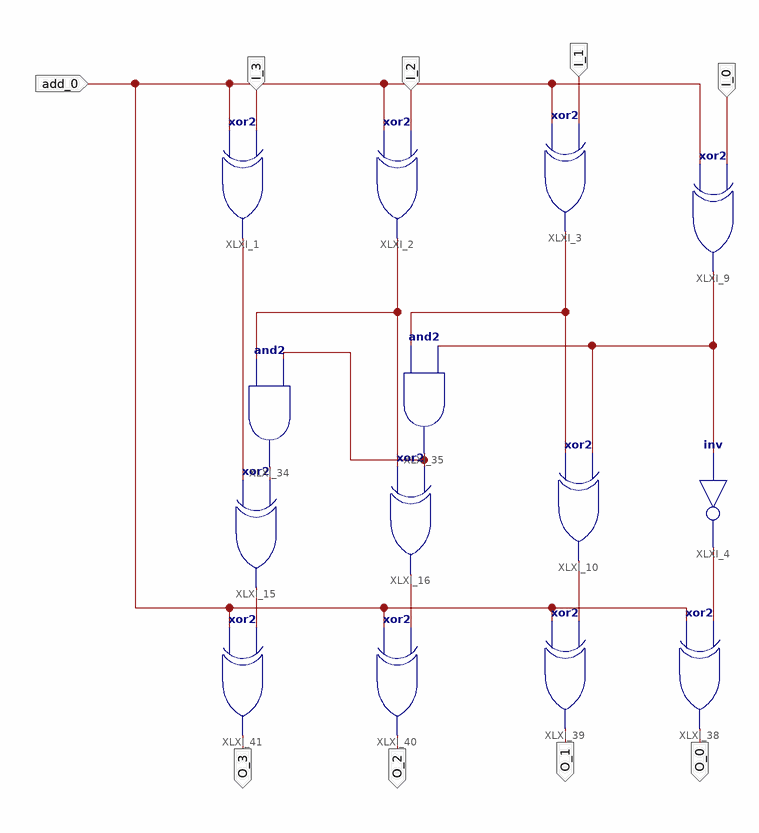
[diagram p0: schematic sheet 1]
// Xilinx ISE schematic Add_sub_4bit.sch (spartan3e) as structural Verilog: 14 symbols, 9 ports
module Add_sub_4bit (
  input  I_3,
  input  I_2,
  input  I_1,
  input  I_0,
  input  add_0,
  output O_3,
  output O_2,
  output O_1,
  output O_0
);

  wire XLXN_2, XLXN_3, XLXN_4, XLXN_52, XLXN_55, XLXN_57, XLXN_63, XLXN_64, XLXN_65, XLXN_66;

  xor XLXI_1 (XLXN_2, add_0, I_3);
  xor XLXI_2 (XLXN_3, add_0, I_2);
  xor XLXI_3 (XLXN_4, add_0, I_1);
  not XLXI_4 (XLXN_63, XLXN_52);
  xor XLXI_9 (XLXN_52, add_0, I_0);
  xor XLXI_10 (XLXN_64, XLXN_4, XLXN_52);
  xor XLXI_15 (XLXN_66, XLXN_2, XLXN_57);
  xor XLXI_16 (XLXN_65, XLXN_3, XLXN_55);
  and XLXI_34 (XLXN_57, XLXN_3, XLXN_55);
  and XLXI_35 (XLXN_55, XLXN_4, XLXN_52);
  xor XLXI_41 (O_3, add_0, XLXN_66);
  xor XLXI_40 (O_2, add_0, XLXN_65);
  xor XLXI_39 (O_1, add_0, XLXN_64);
  xor XLXI_38 (O_0, add_0, XLXN_63);
endmodule
